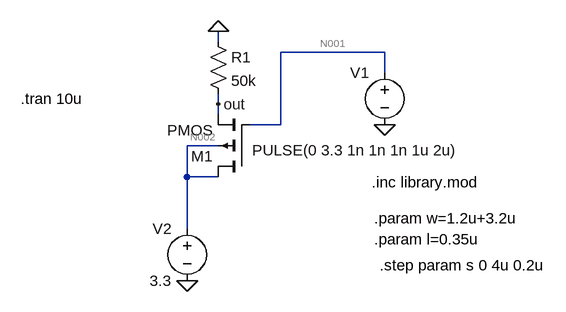
[diagram p0: schematic quiz8.asc]
quiz8.asc, the LTspice schematic file:
Version 4
SHEET 1 1172 680
WIRE 576 80 576 64
WIRE 832 96 672 96
WIRE 832 128 832 96
WIRE 576 176 576 160
WIRE 576 192 576 176
WIRE 672 208 672 96
WIRE 672 208 624 208
WIRE 576 240 528 240
WIRE 528 288 528 240
WIRE 576 288 528 288
WIRE 528 368 528 288
FLAG 832 208 0
FLAG 528 448 0
FLAG 576 176 out
FLAG 576 64 0
SYMBOL voltage 832 112 M0
WINDOW 3 -113 135 Left 2
WINDOW 123 0 0 Left 0
WINDOW 39 0 0 Left 0
SYMATTR Value PULSE(0 3.3 1n 1n 1n 1u 2u)
SYMATTR InstName V1
SYMBOL voltage 528 352 M0
WINDOW 123 0 0 Left 0
WINDOW 39 0 0 Left 0
SYMATTR InstName V2
SYMATTR Value 3.3
SYMBOL pmos4 624 288 R180
SYMATTR InstName M1
SYMATTR Value2 l=l w=w
SYMBOL res 560 64 R0
SYMATTR InstName R1
SYMATTR Value 50k
TEXT 976 296 Right 2 !.inc library.mod
TEXT 272 168 Left 2 !.tran 10u
TEXT 816 352 Left 2 !.param w=1.2u+3.2u
TEXT 816 384 Left 2 !.param l=0.35u
TEXT 824 424 Left 2 !.step param s 0 4u 0.2u

The netlist it stands for:
* quiz8.asc
V1 N001 0 PULSE(0 3.3 1n 1n 1n 1u 2u)
V2 N002 0 3.3
M1 N002 N001 out N002 PMOS l=l w=w
R1 0 out 50k
.model NMOS NMOS
.model PMOS PMOS
.lib standard.mos
.inc library.mod
.tran 10u
.param w=1.2u+3.2u
.param l=0.35u
.step param s 0 4u 0.2u
.backanno
.end

* Results of the author's LTspice run, read from the files saved beside the schematic
* Operating Point (first step), zero values left out:
*   V(n002) = 3.3 V
*   V(out) = 3.209 V
*   Id(M1) = 64.19 µA
*   Is(M1) = -64.19 µA
*   I(R1) = -64.19 µA
*   I(V2) = -64.19 µA
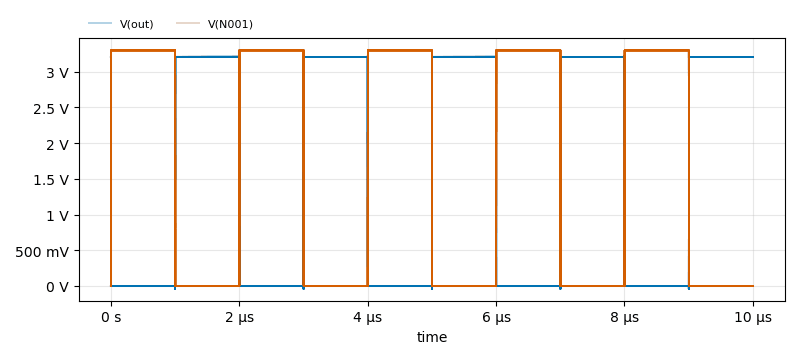
[diagram p1: Transient Analysis of quiz8.asc, plotted from the saved traces]
* Transient Analysis, 21 runs:
*   V(out) [run 1]: min -39.6 mV, max 3.221 V, average 1.604 V, rms 2.268 V, last 3.209 V
*   V(out) [run 2]: min -39.6 mV, max 3.221 V, average 1.604 V, rms 2.268 V, last 3.209 V
*   V(out) [run 3]: min -39.6 mV, max 3.221 V, average 1.604 V, rms 2.268 V, last 3.209 V
*   V(out) [run 4]: min -39.6 mV, max 3.221 V, average 1.604 V, rms 2.268 V, last 3.209 V
*   V(out) [run 5]: min -39.6 mV, max 3.221 V, average 1.604 V, rms 2.268 V, last 3.209 V
*   V(out) [run 6]: min -39.6 mV, max 3.221 V, average 1.604 V, rms 2.268 V, last 3.209 V
*   V(out) [run 7]: min -39.6 mV, max 3.221 V, average 1.604 V, rms 2.268 V, last 3.209 V
*   V(out) [run 8]: min -39.6 mV, max 3.221 V, average 1.604 V, rms 2.268 V, last 3.209 V
*   V(N001) [run 1]: min 0 V, max 3.3 V, average 1.652 V, rms 2.334 V, last 0 V
*   V(N001) [run 2]: min 0 V, max 3.3 V, average 1.652 V, rms 2.334 V, last 0 V
*   V(N001) [run 3]: min 0 V, max 3.3 V, average 1.652 V, rms 2.334 V, last 0 V
*   V(N001) [run 4]: min 0 V, max 3.3 V, average 1.652 V, rms 2.334 V, last 0 V
*   V(N001) [run 5]: min 0 V, max 3.3 V, average 1.652 V, rms 2.334 V, last 0 V
*   V(N001) [run 6]: min 0 V, max 3.3 V, average 1.652 V, rms 2.334 V, last 0 V
*   V(N001) [run 7]: min 0 V, max 3.3 V, average 1.652 V, rms 2.334 V, last 0 V
*   V(N001) [run 8]: min 0 V, max 3.3 V, average 1.652 V, rms 2.334 V, last 0 V